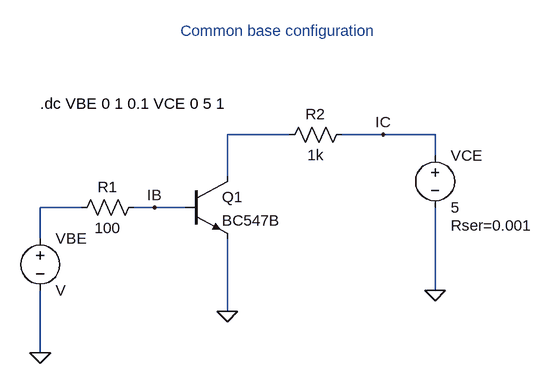
[diagram p0: schematic Ex-2.asc]
Ex-2.asc, the LTspice schematic file:
Version 4
SHEET 1 880 680
WIRE 288 80 192 80
WIRE 432 80 368 80
WIRE 512 80 432 80
WIRE 512 112 512 80
WIRE 192 144 192 80
WIRE -32 192 -96 192
WIRE 80 192 48 192
WIRE 128 192 80 192
WIRE -96 240 -96 192
WIRE 512 320 512 192
WIRE 192 352 192 240
WIRE -96 416 -96 320
FLAG 192 352 0
FLAG -96 416 0
FLAG 512 320 0
FLAG 432 80 IC
FLAG 80 192 IB
SYMBOL voltage -96 224 R0
SYMATTR InstName VBE
SYMBOL voltage 512 96 R0
WINDOW 123 0 0 Left 0
WINDOW 39 24 124 Left 2
SYMATTR InstName VCE
SYMATTR Value 5
SYMATTR SpiceLine Rser=0.001
SYMBOL res 64 176 R90
WINDOW 0 0 56 VBottom 2
WINDOW 3 32 56 VTop 2
SYMATTR InstName R1
SYMATTR Value 100
SYMATTR SpiceLine tol=0.001
SYMBOL res 384 64 R90
WINDOW 0 0 56 VBottom 2
WINDOW 3 32 56 VTop 2
SYMATTR InstName R2
SYMATTR Value 1k
SYMATTR SpiceLine tol=0.001
SYMBOL npn 128 144 R0
SYMATTR InstName Q1
SYMATTR Value BC547B
TEXT -96 32 Left 2 !.dc VBE 0 1 0.1 VCE 0 5 1
TEXT 120 -80 Left 2 ;Common base configuration

The netlist it stands for:
* Ex-2.asc
VBE N002 0 V
VCE IC 0 5 Rser=0.001
R1 IB N002 100 tol=0.001
R2 IC N001 1k tol=0.001
Q1 N001 IB 0 0 BC547B
.model NPN NPN
.model PNP PNP
.lib standard.bjt
.dc VBE 0 1 0.1 VCE 0 5 1
* Common base configuration
.backanno
.end